# EAGLE schematic BusControl (EAGLE 9.6.2)
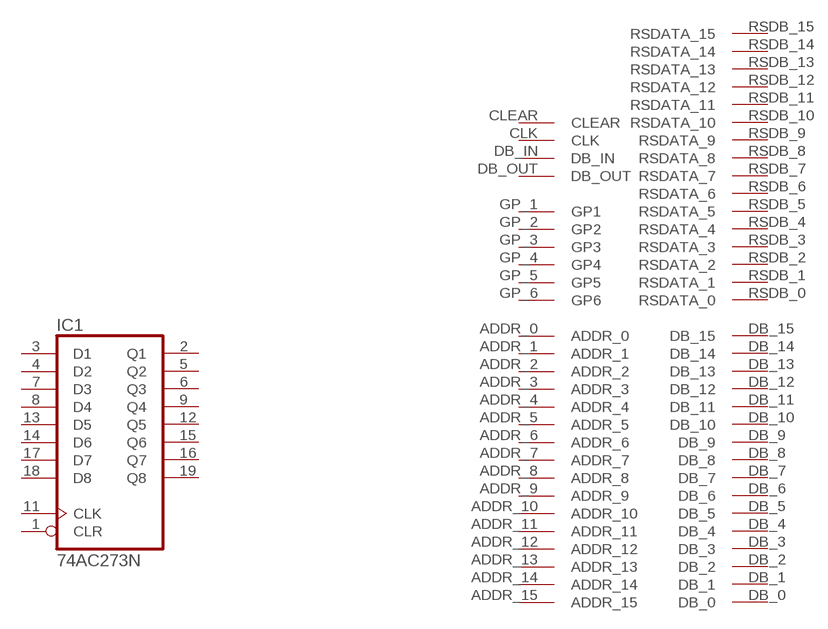
[diagram p0: schematic, sheet 1]

## Parts
IC1  74AC273N  [DIL20]
U$1  BACKPLATE_INTERFACE  [BACK_INTERFACE-FOOT]
Unconnected: IC1.1(CLR) IC1.2(Q1) IC1.3(D1) IC1.4(D2) IC1.5(Q2) IC1.6(Q3) IC1.7(D3) IC1.8(D4) IC1.9(Q4) IC1.11(CLK) IC1.12(Q5) IC1.13(D5) IC1.14(D6) IC1.15(Q6) IC1.16(Q7) IC1.17(D7) IC1.18(D8) IC1.19(Q8) U$1.ADDR_0 U$1.ADDR_1 U$1.ADDR_2 U$1.ADDR_3 U$1.ADDR_4 U$1.ADDR_5 U$1.ADDR_6 U$1.ADDR_7 U$1.ADDR_8 U$1.ADDR_9 U$1.ADDR_10 U$1.ADDR_11 U$1.ADDR_12 U$1.ADDR_13 U$1.ADDR_14 U$1.ADDR_15 U$1.CLEAR U$1.CLK U$1.DB_0 U$1.DB_1 U$1.DB_2 U$1.DB_3 U$1.DB_4 U$1.DB_5 U$1.DB_6 U$1.DB_7 U$1.DB_8 U$1.DB_9 U$1.DB_10 U$1.DB_11 U$1.DB_12 U$1.DB_13 U$1.DB_14 U$1.DB_15 U$1.DB_IN U$1.DB_OUT U$1.GP_1(GP1) U$1.GP_2(GP2) U$1.GP_3(GP3) U$1.GP_4(GP4) U$1.GP_5(GP5) U$1.GP_6(GP6) U$1.NC_0 U$1.NC_1 U$1.RSDB_0(RSDATA_0) U$1.RSDB_1(RSDATA_1) U$1.RSDB_2(RSDATA_2) U$1.RSDB_3(RSDATA_3) U$1.RSDB_4(RSDATA_4) U$1.RSDB_5(RSDATA_5) U$1.RSDB_6(RSDATA_6) U$1.RSDB_7(RSDATA_7) U$1.RSDB_8(RSDATA_8) U$1.RSDB_9(RSDATA_9) U$1.RSDB_10(RSDATA_10) U$1.RSDB_11(RSDATA_11) U$1.RSDB_12(RSDATA_12) U$1.RSDB_13(RSDATA_13) U$1.RSDB_14(RSDATA_14) U$1.RSDB_15(RSDATA_15)

## Power pins joined to a net without a drawn wire
GND: IC1.10(GND) U$1.GND U$1.GND2(GND)
VCC: IC1.20(VCC) U$1.VCC U$1.VCC2(VCC)

## Library data of the parts
IC1 = 74xx-eu:74*273: Octal D type FLIP FLOP, clear
U$1 = Computer:BACKPLATE_INTERFACE